# Altium project pr1.PrjPcb
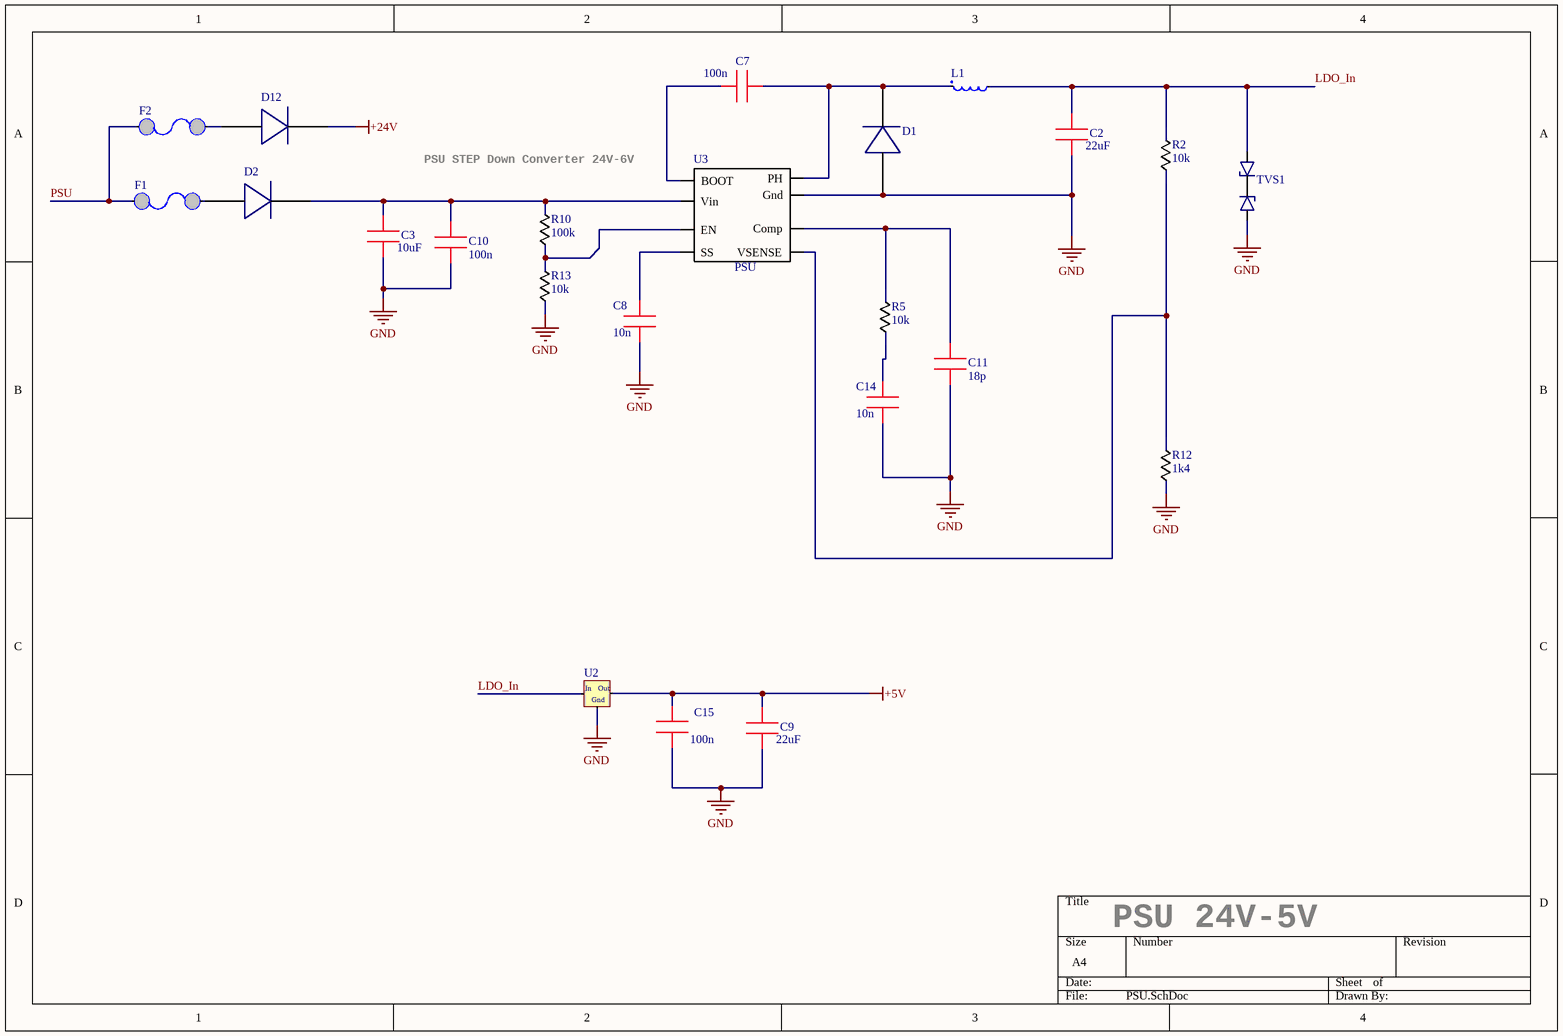
[diagram p0: PSU.SchDoc]
4 sheets, 90 parts. Net scope: global (net labels, ports and power ports of the same name join across sheets).
Board file: ÌÖÒÐ.00010582.00.002.PcbDoc
Sheets:
  PSU.SchDoc
  CPU.SchDoc
  RS485.SchDoc
  Relays.SchDoc

## Sheet PSU.SchDoc
size A4

### Parts
C2  22uF  [1206_CAP]
C3  10uF  [1206_CAP]
C7  100n  [0603_Cap]
C8  10n  [0603_Cap]
C9  22uF  [1206_CAP]
C10  100n  [0603_Cap]
C11  18p  [0603_Cap]
C14  10n  [0603_Cap]
C15  100n  [0603_Cap]
D1  (no value)  [B340A-13-F]
D2  (no value)  [B340A-13-F]
D12  (no value)  [B340A-13-F]
F1  (no value)  [Fuse USMF030]
F2  (no value)  [Fuse USMF030]
L1  (no value)  [CDRH127/LDNP-270MC,]
R2  10k  [0603_Res]
R5  10k  [0603_Res]
R10  100k  [0603_Res]
R12  1k4  [0603_Res]
R13  10k  [0603_Res]
TVS1  TVS Diode  [SM6T]  (value not drawn)
U2  (no value)  [SOT223]
U3  PSU  [SOIC 8]

### Nets
+5V: C9.2 C15.1 U2.2(OUT)
+24V: D12.1
GND: C2.1 C3.1 C8.1 C9.1 C10.1 C11.1 C14.1 C15.2 D1.2 R12.1 R13.1 TVS1.1 U2.1(GND) U3.7(Gnd)
LDO_In: C2.2 L1.2 R2.2 TVS1.2 U2.3(IN)
PSU: F1.1 F2.1
NetC3_2: C3.2 C10.2 D2.1 R10.2 U3.2(Vin)
NetC7_1: C7.1 U3.1(BOOT)
NetC7_2: C7.2 D1.1 L1.1 U3.8(PH)
NetC8_2: C8.2 U3.4(SS)
NetC11_2: C11.2 R5.2 U3.6(Comp)
NetC14_2: C14.2 R5.1
NetD2_2: D2.2 F1.0
NetD12_2: D12.2 F2.0
NetR2_1: R2.1 R12.2 U3.5(VSENSE)
NetR10_1: R10.1 R13.2 U3.3(EN)

### Notes on the sheet
- PSU STEP Down Converter 24V-6V
- PSU 24V-5V
- (in symbol NCV1117ST50T3G) In; Out; Gnd

### Library data of the parts
C2 C9 = 0805 Cap: Part Description: Multilayer Ceramic Capacitor 16V 22uF X5R 1206 10%; Part Number: CC1206KKX5R7BB226
C3 = 0805 Cap: Part Description: Capacitors MLCC 50V 10uF X5R 1206 10%; Part Number: CC1206KKX5R9BB106
C7 C10 = 0805 Cap: Part Description: Multilayer Ceramic Capacitor 50 V 0.1uF Y5V 0603 -20/+80%; Part Number: CC0603ZRY5V9BB104
C8 C14 = 0805 Cap: Part Description: Multilayer Ceramic Capacitor 50V 0.01uF Y5V 0603 -20/+80%; Part Number: CC0603ZRY5V9BB103
C11 = 0603 CAP: Part Description: Multilayer Ceramic Capacitor 50 V 18 pF C0G 0603 5%; Part Number: CC0603JRNPO9BN180
C15 = Capasitor 0805: Part Description: Multilayer Ceramic Capacitor 50 V 0.1uF Y5V 0603 -20/+80%; Part Number: CC0603ZRY5V9BB104
D1 = B340A-13-F: Part Description: Schottky Diodes 40V 3A; Part Number: B340A-13-F
D2 = B340A-13-F: Part Number: Schottky Diode 40V 3A; Part Description: B340A-13-F
D12 = B340A-13-F: Part Description: Schottky Diode 40V 3A; Part Number: B340A-13-F
F1 F2 = Fuse PTS: Part Description: Resettable Fuses - PPTC 30V 300MA; Part Number: MF-MSMF030-2
L1 = CDRH127/LDNP-270MC: Part Description: Power Inductors - SMD 22uH 4.7A; Part Number: CDRH127/LDNP-220MC
R2 R5 R13 = Resistor 0805: Part Description: Thin Film Resistors - SMD 10K ohm 1% 1/10W; Part Number: RT0603FRE0710KL
R10 = Resistor 0805: Part Description: Thick Film Resistor - 0603, 100kOhms, 1%, 1/10W; Part Number: RC0603FR-07100KL
R12 = Resistor 0805: Part Description: Thick Film Resistor 0603, 1.4kOhms, 1%, 1/10W; Part Number: RC0603FR-071K4L
TVS1 = SM6T12CA: Part Description: TVS Diodes 600W 12V Bidirect; Part Number: SM6T12CA
U2 = NCV1117ST50T3G: Part Description: LDO 800MA 5V; Part Number: LM1117MPX-5.0
U3 = TPS54331: Part Description: Switching Voltage Regulators 3A 28V; Part Number: TPS54331DR

## Sheet CPU.SchDoc
size A4
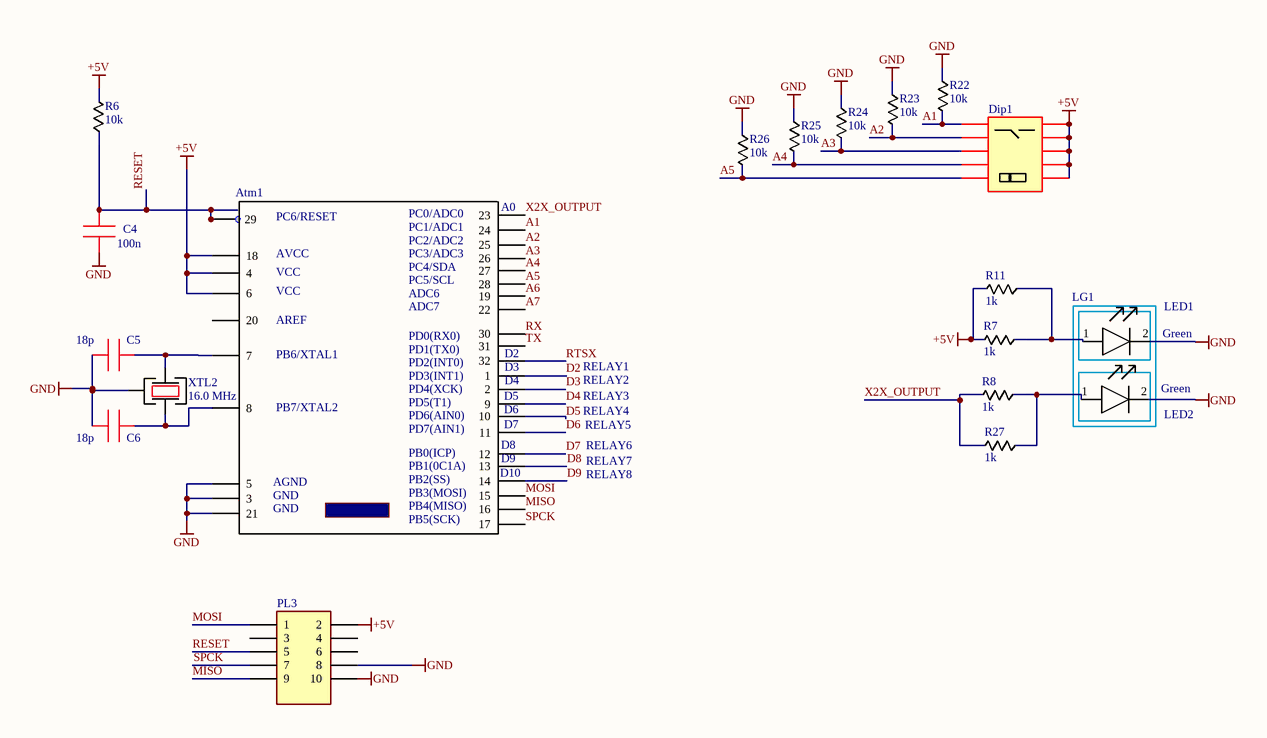
[diagram p1: CPU.SchDoc]

### Parts
Atm1  (no value)  [Atmega168]
C4  100n  [0603_Cap]
C5  18p  [0603_Cap]
C6  18p  [0603_Cap]
Dip1  (no value)  [DipSwitch 5]
LED1  (no value)  [0603 - LED]
LED2  (no value)  [0603 - LED]
LG1  (no value)  [LED SMD DayLight]
PL3  (no value)  [IDC-10MS]
R6  10k  [0603_Res]
R7  1k  [0603_Res]
R8  1k  [0603_Res]
R11  1k  [0603_Res]
R22  10k  [0603_Res]
R23  10k  [0603_Res]
R24  10k  [0603_Res]
R25  10k  [0603_Res]
R26  10k  [0603_Res]
R27  1k  [0603_Res]
XTL2  16.0 MHz  [KX-7 XTAL]

### Nets
+5V: Atm1.4 Atm1.6 Atm1.18 Dip1.1 Dip1.2 Dip1.3 Dip1.4 Dip1.5 PL3.2 R6.2 R7.2 R11.2
GND: Atm1.3 Atm1.5 Atm1.21 C4.1 C5.1 C6.1 LED1.2 LED2.2 PL3.8 PL3.10 R22.1 R23.1 R24.1 R25.1 R26.1 XTL2.2
A1: Atm1.24 Dip1.12 R22.2
A2: Atm1.25 Dip1.13 R23.2
A3: Atm1.26 Dip1.14 R24.2
A4: Atm1.27 Dip1.15 R25.2
A5: Atm1.28 Dip1.16 R26.2
A6: Atm1.19
A7: Atm1.22
D2: Atm1.1
D3: Atm1.2
D4: Atm1.9
D5: Atm1.10
D6: Atm1.11
D7: Atm1.12
D8: Atm1.13
D9: Atm1.14
MISO: Atm1.16 PL3.9
MOSI: Atm1.15 PL3.1
RESET: Atm1.29 C4.2 PL3.5 R6.1
RTSX: Atm1.32
RX: Atm1.30
SPCK: Atm1.17 PL3.7
TX: Atm1.31
X2X_OUTPUT: Atm1.23 R8.2 R27.2
NetAtm1_7: Atm1.7 C5.2 XTL2.1
NetAtm1_8: Atm1.8 C6.2 XTL2.3
NetLED1_1: LED1.1 R7.1 R11.1
NetLED2_1: LED2.1 R8.1 R27.1

Not connected (* = marked no-connect by the designer): Atm1 20; PL3 3 4 6

### Notes on the sheet
- (near Atm1) A0
- (near Atm1) D3
- (near Atm1) D2
- RELAY1
- (near LED1) Green
- (near Atm1) D5
- (near Atm1) D6
- (near Atm1) D7
- (near Atm1) D4
- RELAY2
- RELAY3
- RELAY4
- RELAY5
- Green
- (near Atm1) D10
- (near Atm1) D8
- (near Atm1) D9
- RELAY7
- RELAY8
- RELAY6
- (in symbol Atmega328) PC0/ADC0; PC6/RESET; PC1/ADC1; PC2/ADC2; AVCC; PC3/ADC3; PC4/SDA; VCC; PC5/SCL; ADC6; ADC7; AREF; PD0(RX0); PB6/XTAL1; PD1(TX0); PD2(INT0); PD3(INT1); PD4(XCK); PD5(T1); PB7/XTAL2; PD6(AIN0); PD7(AIN1); PB0(ICP); PB1(0C1A); AGND; PB2(SS); GND; ATMega328; PB3(MOSI); PB4(MISO); PB5(SCK)

### Library data of the parts
Atm1 = Atmega328: Part Description: 8-bit MCU 32KB 20MHz 1.8V-5.5V; Part Number: Atmega328P-AU
C4 = Capasitor 0805: as C15 on sheet PSU
C5 C6 = Capasitor 0805: Part Description: Multilayer Ceramic Capacitor 50 V 18 pF C0G 0603 5%; Part Number: CC0603JRNPO9BN180
Dip1 = DipSwitch5: Part Description: Bit switch 5 bits; Part Number: DPL-05-V
LED1 LED2 = LED 0603: Part Number: KP-1608SGC; Part Description: 0603 Single Colour LED Green
LG1 = Light Guide 2: Part Number: 5151094F; Part Description: Light Guide
PL3 = IDC-10MS: Part Description: Socket; IDC; male; PIN: 10; straight;; Part Number: DS1013-10SSIB1-B-0
R6 R22-R26 = Resistor 0805: as R2 on sheet PSU
R7 R8 R11 R27 = Resistor 0805: Part Description: Thick Film Resistor - 0603, 1kOhms, 1%, 1/10W; Part Number: RC0603FR-071KL
XTL2 = KX-7: Part Description: CRYSTAL 16.0000MHZ 18PF; Part Number: Geyer KX-7 16.0 MHz

## Sheet RS485.SchDoc
size A4
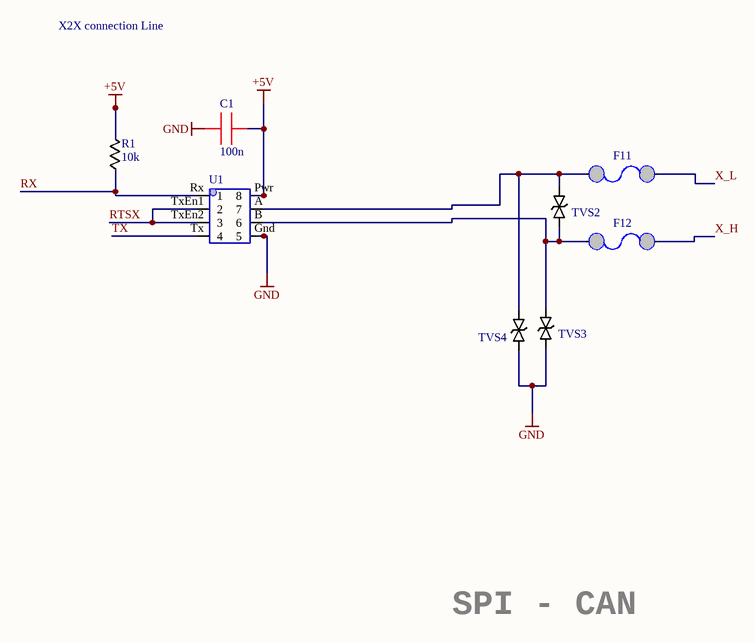
[diagram p2: RS485.SchDoc]

### Parts
C1  100n  [0603_Cap]
F11  Fuse PTS  [1210_MF]  (value not drawn)
F12  Fuse PTS  [1210_MF]  (value not drawn)
R1  10k  [0603_Res]
TVS2  (no value)  [DO-214AC]
TVS3  (no value)  [DO-214AC]
TVS4  (no value)  [DO-214AC]
U1  (no value)  [EIA485]

### Nets
+5V: C1.2 R1.2 U1.Pwr(8)
GND: C1.1 TVS3.1 TVS4.1 U1.Gnd(5)
RTSX: U1.TxEn1(2) U1.TxEn2(3)
RX: R1.1 U1.Rx(1)
TX: U1.Tx(4)
X_H: F12.1
X_L: F11.1
NetF11_2: F11.2 TVS2.2 TVS4.2 U1.A(7)
NetF12_2: F12.2 TVS2.1 TVS3.2 U1.B(6)

### Notes on the sheet
- X2X connection Line
- SPI - CAN

### Library data of the parts
C1 = Capasitor 0805: as C15 on sheet PSU
F11 F12 = Fuse PTS: Part Description: Resettable Fuses - PPTC 30V 50MA; Part Number: MF-USMF005-2
R1 = Resistor 0805: as R2 on sheet PSU
TVS2-TVS4 = SMAJ5.0CA: Part Description: ESD Protection Diodes 5volts 800/1600uA 43.5 Amps Bi-Dir; Part Number: SMAJ5.0CA
U1 = MAX485: Part Description: RS-485 Interface IC Low-Power; Part Number: SN65HVD3082EDR

## Sheet Relays.SchDoc
size A3
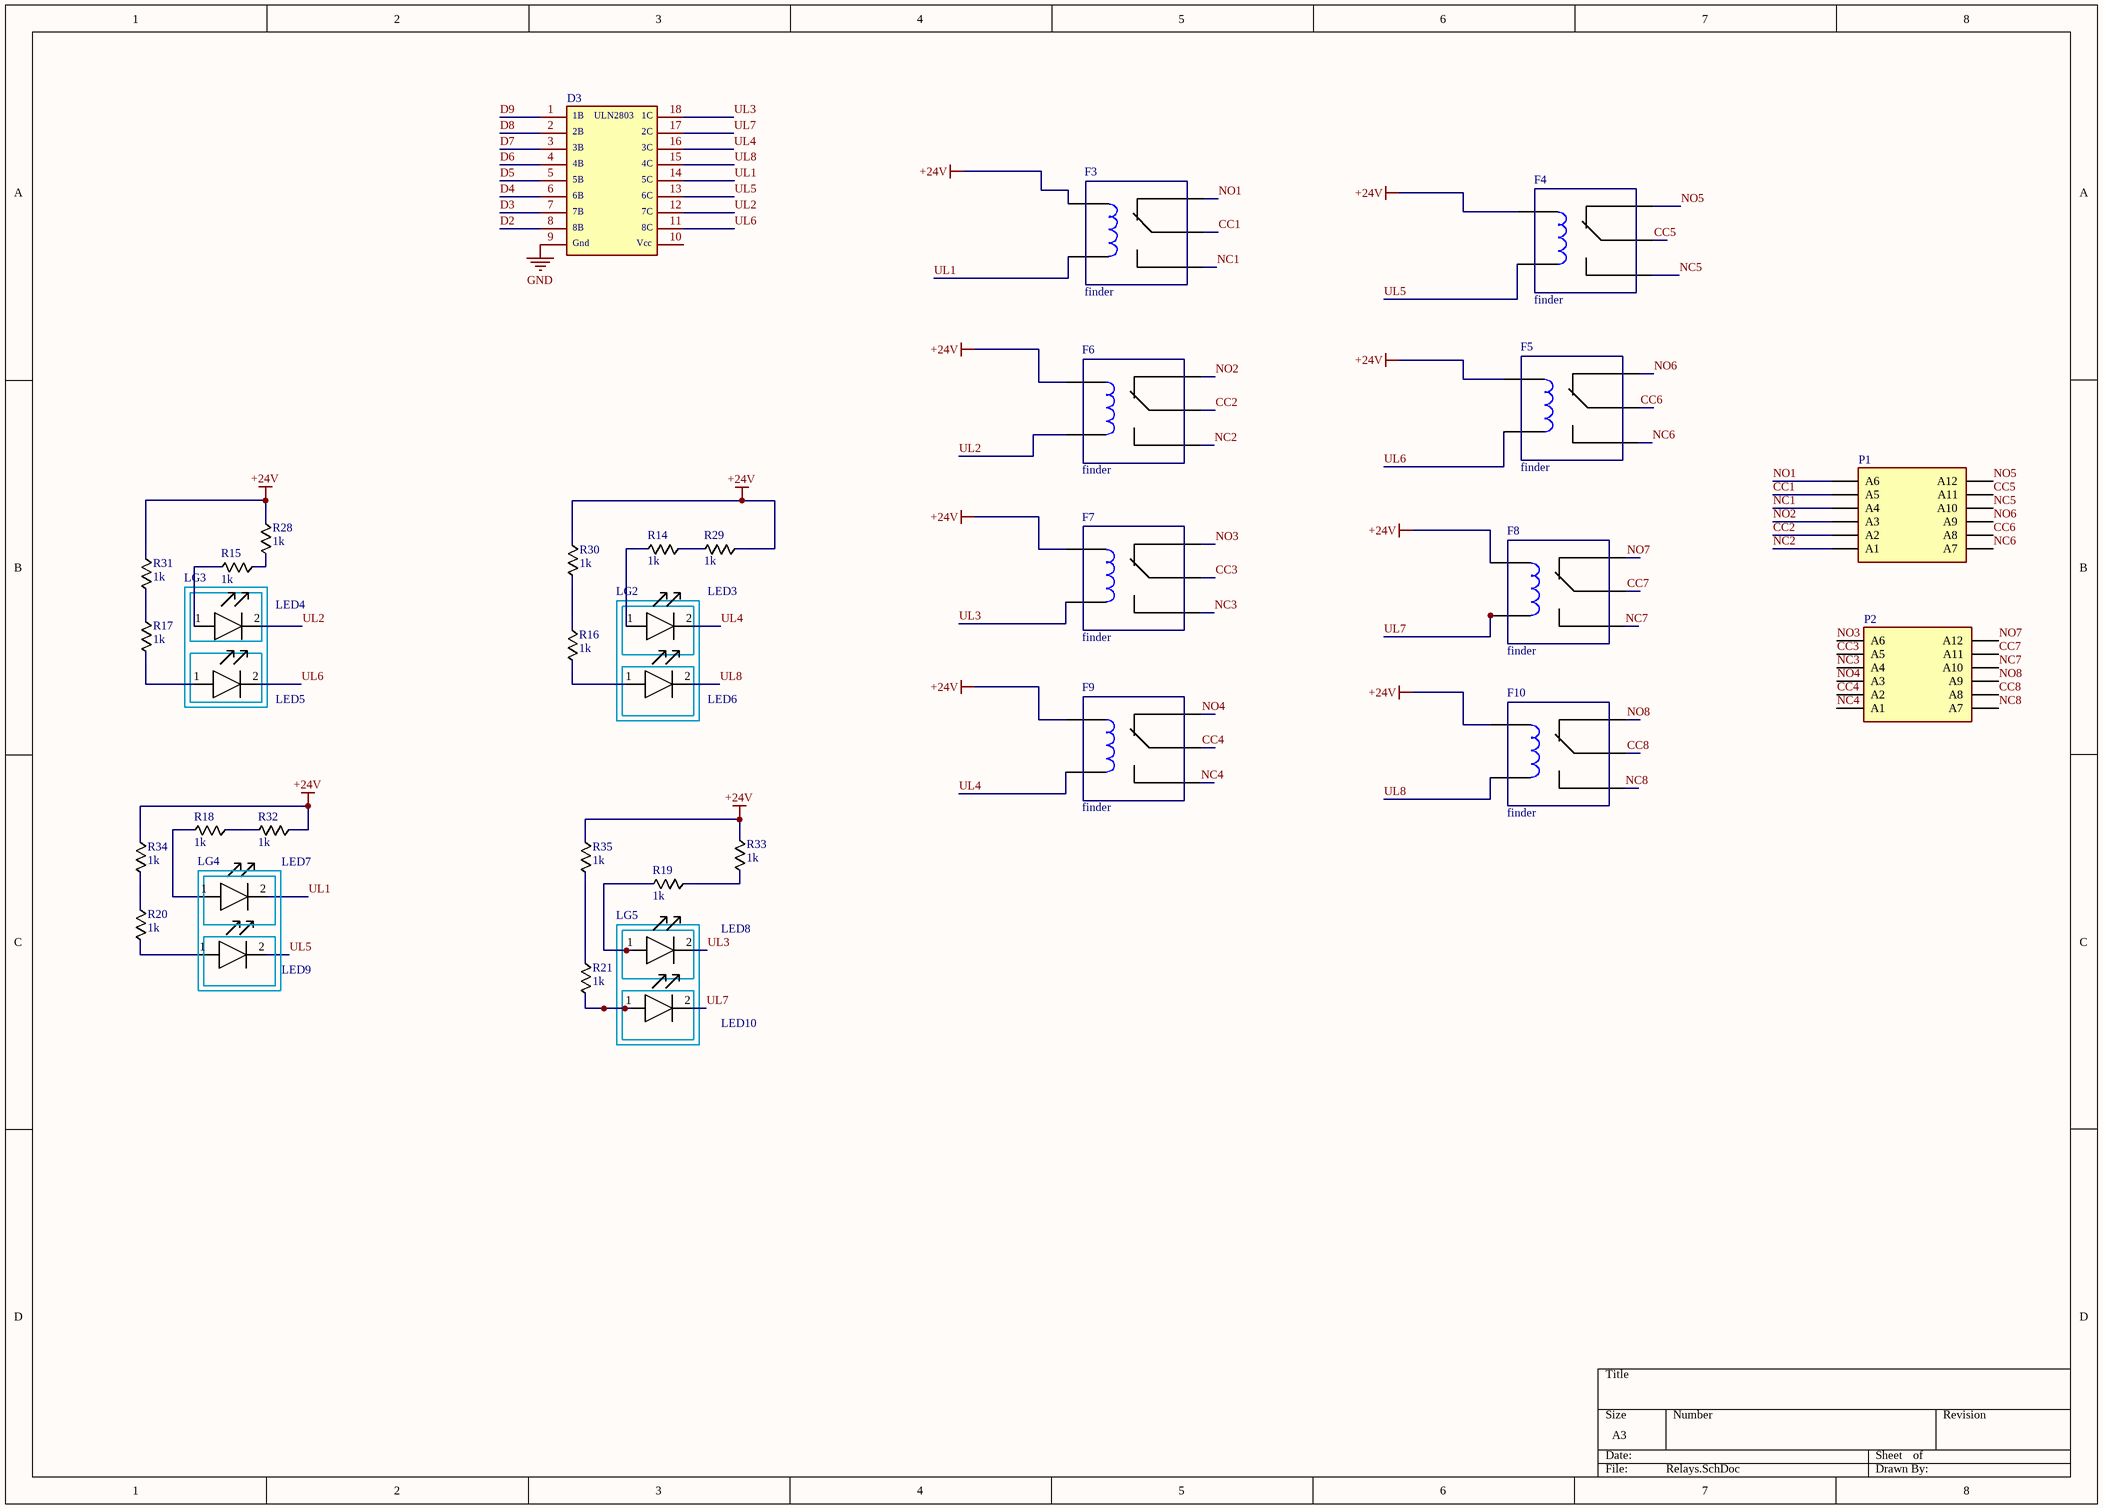
[diagram p3: Relays.SchDoc]

### Parts
D3  (no value)  [SOIC 18]
F3  finder  [413190240010]
F4  finder  [413190240010]
F5  finder  [413190240010]
F6  finder  [413190240010]
F7  finder  [413190240010]
F8  finder  [413190240010]
F9  finder  [413190240010]
F10  finder  [413190240010]
LED3  (no value)  [0603 - LED]
LED4  (no value)  [0603 - LED]
LED5  (no value)  [0603 - LED]
LED6  (no value)  [0603 - LED]
LED7  (no value)  [0603 - LED]
LED8  (no value)  [0603 - LED]
LED9  (no value)  [0603 - LED]
LED10  (no value)  [0603 - LED]
LG2  (no value)  [LED SMD DayLight]
LG3  (no value)  [LED SMD DayLight]
LG4  (no value)  [LED SMD DayLight]
LG5  (no value)  [LED SMD DayLight]
P1  (no value)  [mcd 1,5/6-G1-3.81]
P2  (no value)  [mcd 1,5/6-G1-3.81]
R14  1k  [0603_Res]
R15  1k  [0603_Res]
R16  1k  [0603_Res]
R17  1k  [0603_Res]
R18  1k  [0603_Res]
R19  1k  [0603_Res]
R20  1k  [0603_Res]
R21  1k  [0603_Res]
R28  1k  [0603_Res]
R29  1k  [0603_Res]
R30  1k  [0603_Res]
R31  1k  [0603_Res]
R32  1k  [0603_Res]
R33  1k  [0603_Res]
R34  1k  [0603_Res]
R35  1k  [0603_Res]

### Nets
+24V: F3.A2 F4.A2 F5.A2 F6.A2 F7.A2 F8.A2 F9.A2 F10.A2 R28.1 R29.1 R30.1 R31.1 R32.1 R33.1 R34.1 R35.1
GND: D3.9
CC1: F3.11 P1.3(A5)
CC2: F6.11 P1.9(A2)
CC3: F7.11 P2.3(A5)
CC4: F9.11 P2.9(A2)
CC5: F4.11 P1.4(A11)
CC6: F5.11 P1.10(A8)
CC7: F8.11 P2.4(A11)
CC8: F10.11 P2.10(A8)
D2: D3.8
D3: D3.7
D4: D3.6
D5: D3.5
D6: D3.4
D7: D3.3
D8: D3.2
D9: D3.1
NC1: F3.14 P1.5(A4)
NC2: F6.14 P1.11(A1)
NC3: F7.14 P2.5(A4)
NC4: F9.14 P2.11(A1)
NC5: F4.14 P1.6(A10)
NC6: F5.14 P1.12(A7)
NC7: F8.14 P2.6(A10)
NC8: F10.14 P2.12(A7)
NO1: F3.12 P1.1(A6)
NO2: F6.12 P1.7(A3)
NO3: F7.12 P2.1(A6)
NO4: F9.12 P2.7(A3)
NO5: F4.12 P1.2(A12)
NO6: F5.12 P1.8(A9)
NO7: F8.12 P2.2(A12)
NO8: F10.12 P2.8(A9)
UL1: D3.14 F3.A1 LED7.2
UL2: D3.12 F6.A1 LED4.2
UL3: D3.18 F7.A1 LED8.2
UL4: D3.16 F9.A1 LED3.2
UL5: D3.13 F4.A1 LED9.2
UL6: D3.11 F5.A1 LED5.2
UL7: D3.17 F8.A1 LED10.2
UL8: D3.15 F10.A1 LED6.2
NetLED3_1: LED3.1 R14.2
NetLED4_1: LED4.1 R15.2
NetLED5_1: LED5.1 R17.2
NetLED6_1: LED6.1 R16.2
NetLED7_1: LED7.1 R18.2
NetLED8_1: LED8.1 R19.2
NetLED9_1: LED9.1 R20.2
NetLED10_1: LED10.1 R21.2
NetR14_1: R14.1 R29.2
NetR15_1: R15.1 R28.2
NetR16_1: R16.1 R30.2
NetR17_1: R17.1 R31.2
NetR18_1: R18.1 R32.2
NetR19_1: R19.1 R33.2
NetR20_1: R20.1 R34.2
NetR21_1: R21.1 R35.2

Not connected (* = marked no-connect by the designer): D3 10

### Notes on the sheet
- (in symbol ULN2803 Darlington_1) 1B; ULN2803; 1C; 2B; 2C; 3B; 3C; 4B; 4C; 5B; 5C; 6B; 6C; 7B; 7C; 8B; 8C; Gnd; Vcc

### Library data of the parts
D3 = ULN2803 Darlington_1: Part Description: Darlington Transistors Eight NPN Array; Part Number: ULN2803ADWR
F3 = finder: Part Description: General Purpose Relays; Part Number: G2RL124DC
F4-F10 = finder: G2RL124DC; Part Description: General Purpose Relays; Part Number: G2RL124DC
LED3-LED10 = LED 0603: as LED1 on sheet CPU
LG2-LG5 = Light Guide 2: Part Number: 5151094F; Part Description: Light Guide
P1 P2 = MCD 1.5/6 Phoenix: Part Description: Pluggable Terminal Blocks; LatestRevisionDate: 17-Jul-2002; LatestRevisionNote: Re-released for DXP Platform.; Publisher: Altium Limited; Part Number: MCD 1.5/6 Phoenix
R14-R21 R28-R35 = Resistor 0805: as R7 on sheet CPU

## Nets that join several sheets
+5V: PSU (C9.2 C15.1 U2.2), CPU (12 pins), RS485 (C1.2 R1.2 U1.Pwr)
+24V: PSU (D12.1), Relays (16 pins)
GND: PSU (14 pins), CPU (16 pins), RS485 (C1.1 TVS3.1 TVS4.1 U1.Gnd), Relays (D3.9)
D2: CPU (Atm1.1), Relays (D3.8)
D3: CPU (Atm1.2), Relays (D3.7)
D4: CPU (Atm1.9), Relays (D3.6)
D5: CPU (Atm1.10), Relays (D3.5)
D6: CPU (Atm1.11), Relays (D3.4)
D7: CPU (Atm1.12), Relays (D3.3)
D8: CPU (Atm1.13), Relays (D3.2)
D9: CPU (Atm1.14), Relays (D3.1)
RTSX: CPU (Atm1.32), RS485 (U1.TxEn1 U1.TxEn2)
RX: CPU (Atm1.30), RS485 (R1.1 U1.Rx)
TX: CPU (Atm1.31), RS485 (U1.Tx)